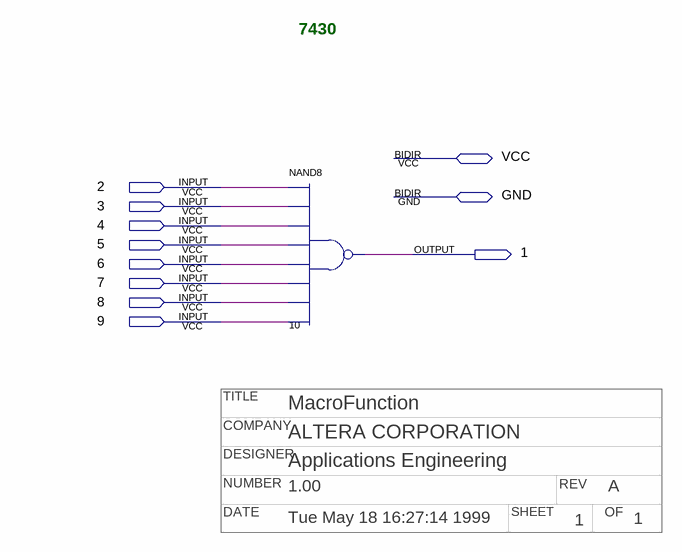
[diagram p0: schematic sheet]
// Quartus schematic np7430.bdf as structural Verilog: 1 symbols, 11 pins
// Title block: TITLE: MacroFunction; COMPANY: ALTERA CORPORATION; DESIGNER: Applications Engineering; NUMBER: 1.00; REV: A; DATE: Tue May 18 16:27:14 1999; SHEET: 1; OF: 1
module np7430 (
  input  \2 ,
  input  \3 ,
  input  \4 ,
  input  \5 ,
  input  \6 ,
  input  \7 ,
  input  \8 ,
  input  \9 ,
  inout  VCC,
  inout  GND,
  output \1 
);

  nand u_10 (\1 , \2 , \3 , \4 , \5 , \6 , \7 , \8 , \9 );

  // Notes on the sheet:
  //   7430
endmodule
